# Altium project PM01L_轻量巡线小车.PrjPcb
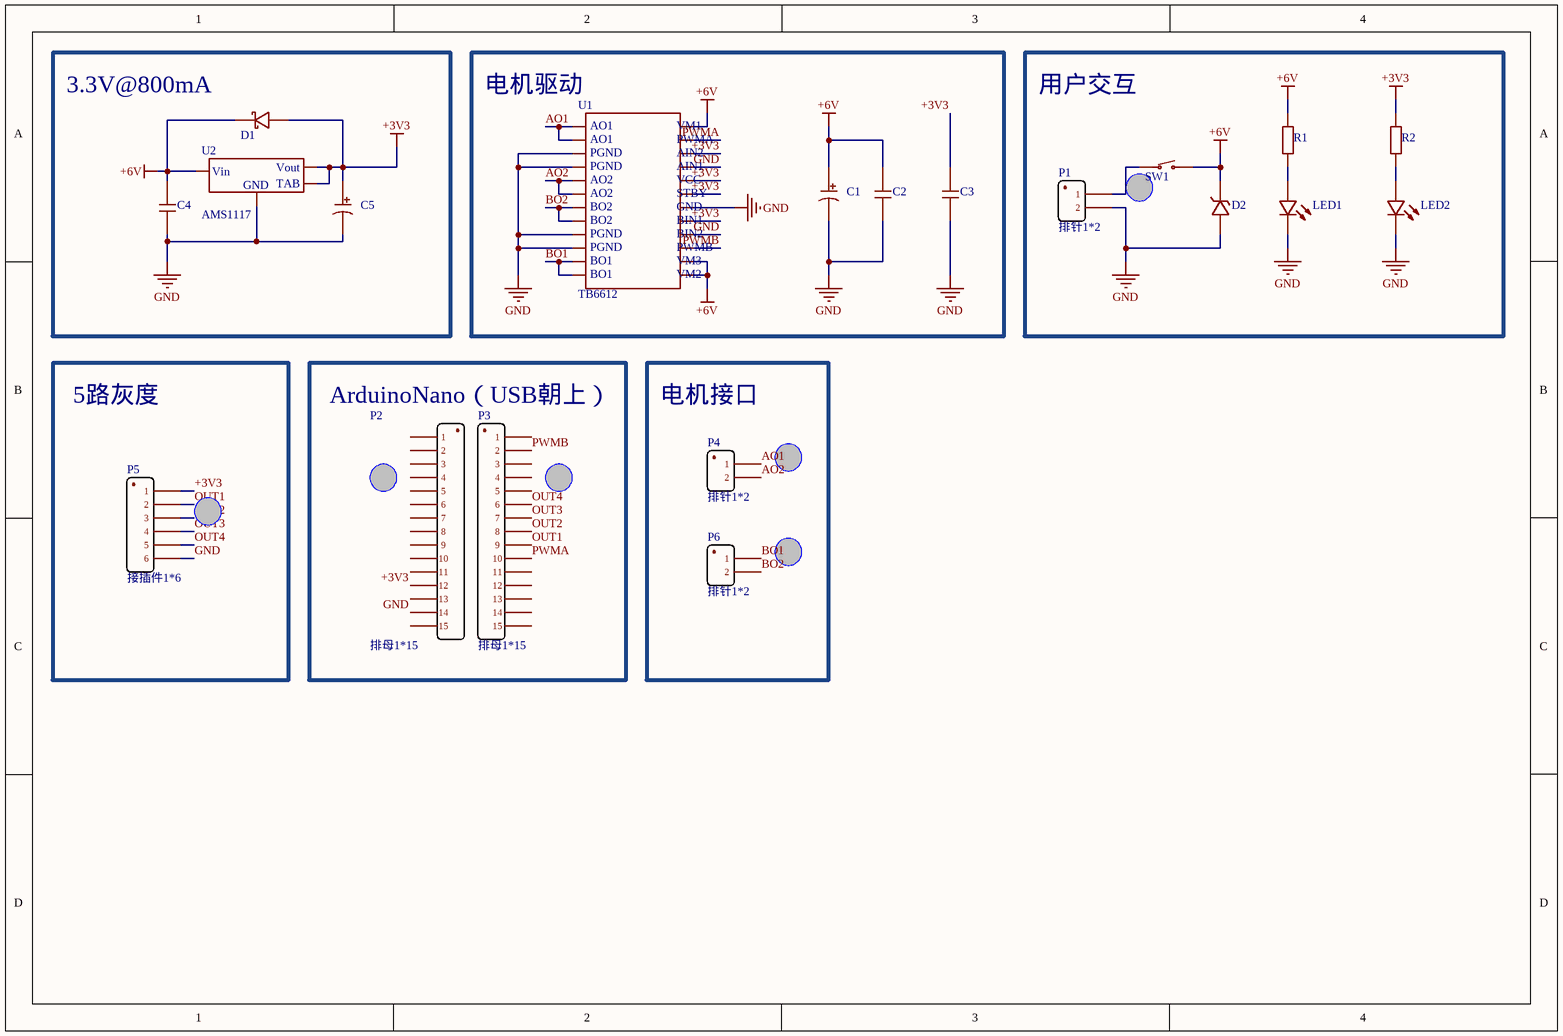
[diagram p0: main.SchDoc]
1 sheet, 20 parts. Net scope: global (net labels, ports and power ports of the same name join across sheets).
Board file: V2.PcbDoc

## Sheet main.SchDoc
size A4; SheetNumber: 1; SheetTotal: 1

### Parts
C1  10uF  [3528B/1210]  (value not drawn)
C2  0.1uF  [0805C]  (value not drawn)
C3  0.1uF  [0805C]  (value not drawn)
C4  10uF  [0603C]  (value not drawn)
C5  100uF  [3528B/1210]  (value not drawn)
D1  SS34  [SMA]  (value not drawn)
D2  瞬态抑制二极管  [SMA]  (value not drawn)
LED1  LED  [0603D]  (value not drawn)
LED2  LED  [0603D]  (value not drawn)
P1  排针1*2  [Pin-PB-M-1*2]
P2  排母1*15  [Pin-PB-F-1*15]
P3  排母1*15  [Pin-PB-F-1*15]
P4  排针1*2  [Pin-PB-M-1*2]
P5  接插件1*6  [XH2.54_AW_1*6]
P6  排针1*2  [Pin-PB-M-1*2]
R1  4K7  [0603R]  (value not drawn)
R2  4K7  [0603R]  (value not drawn)
SW1  开关  [*SW-5.08mm]  (value not drawn)
U1  TB6612  [SSOP24]
U2  AMS1117  [SOT-223]

### Blocks framed on the sheet
3.3V@800mA: C4 C5 D1 U2
电机驱动: C1-C3 U1
用户交互: D2 LED1 LED2 P1 R1 R2 SW1
5路灰度: P5
ArduinoNano（USB朝上）: P2 P3
电机接口: P4 P6

### Nets
+3V3: C3.2 C5.1 D1.1 P2.12 P5.1 R2.2 U1.17 U1.19 U1.20 U1.22 U2.2 U2.4
+6V: C1.1 C2.2 C4.2 D1.2 D2.2 R1.2 SW1.2 U1.13 U1.14 U1.24 U2.3
GND: C1.2 C2.1 C3.1 C4.1 C5.2 D2.1 LED1.2 LED2.2 P1.2 P2.14 P5.6 U1.3 U1.4 U1.9 U1.10 U1.16 U1.18 U1.21 U2.1
AO1: P4.1 U1.1 U1.2
AO2: P4.2 U1.5 U1.6
BO1: P6.1 U1.11 U1.12
BO2: P6.2 U1.7 U1.8
OUT1: P3.9 P5.2
OUT2: P3.8 P5.3
OUT3: P3.7 P5.4
OUT4: P3.6 P5.5
PWMA: P3.10 U1.23
PWMB: P3.2 U1.15
NetLED1_1: LED1.1 R1.1
NetLED2_1: LED2.1 R2.1
NetP1_1: P1.1 SW1.1

Not connected (* = marked no-connect by the designer): P2 1 2 3 4 5 6 7 8 9 10 11 13 15; P3 1 3 4 5 11 12 13 14 15

### Notes on the sheet
- (in symbol 芯片/IC-电机驱动-TB6612) AO1; VM1; PWMA; PGND; AIN2; AIN1; AO2; VCC; STBY; BO2; GND; BIN1; BIN2; PWMB; BO1; VM3; VM2
- (in symbol 芯片/IC-线性稳压管-AMS1117) Vout; Vin; TAB; GND

### Library data of the parts
C1 C5 = 电容_贴片钽
C2-C4 = 电容_贴片
D1 = 二极管_肖特基
D2 = 二极管_瞬态抑制
LED1 LED2 = 二极管_贴片发光
P1 P4 P6 = 接插件1*2
P2 P3 = 接插件1*15
R1 R2 = 电阻_贴片
SW1 = 开关_二脚
U1 = 芯片/IC-电机驱动-TB6612
U2 = 芯片/IC-线性稳压管-AMS1117